# Altium schematic sheet MemoryChip.SchDoc
size A4
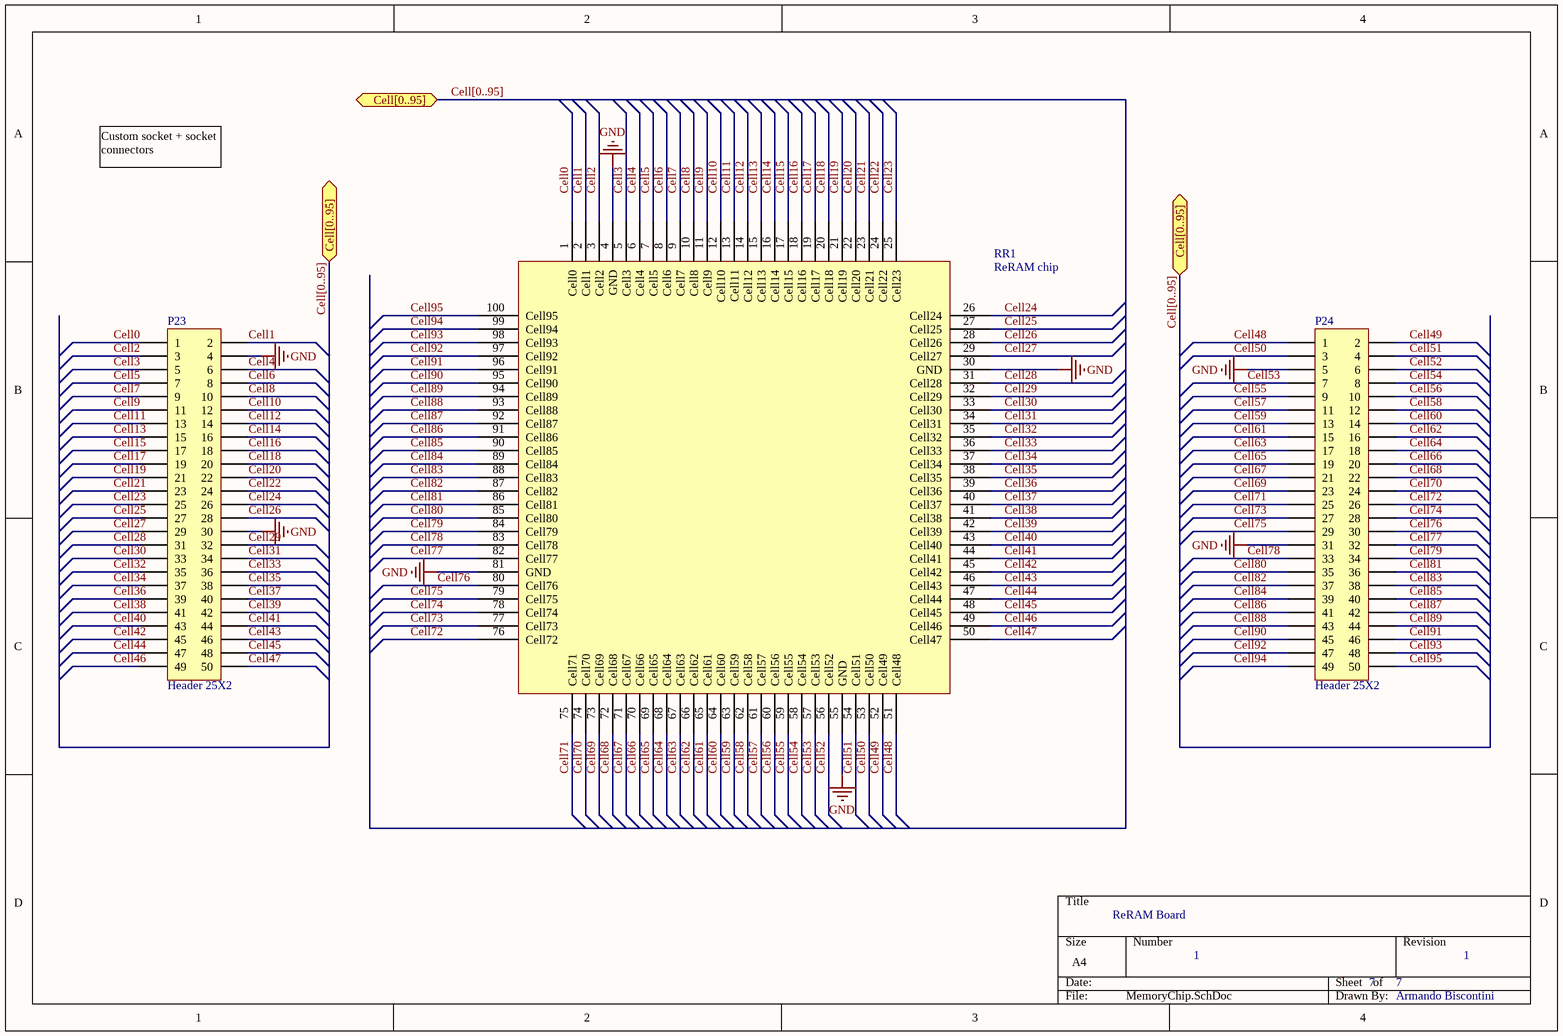
[diagram p0: MemoryChip.SchDoc]

## Parts
P23  Header 25X2  [HDR2X25]
P24  Header 25X2  [HDR2X25]
RR1  ReRAM chip  [LSI-PLLGA100]

## Ports
Cell[0..95]

## Nets
GND: P23.4 P23.30 P24.5 P24.31 RR1.4(GND) RR1.30(GND) RR1.55(GND) RR1.81(GND)
Cell0: P23.1 RR1.1(Cell0)
Cell1: P23.2 RR1.2(Cell1)
Cell2: P23.3 RR1.3(Cell2)
Cell3: P23.5 RR1.5(Cell3)
Cell4: P23.6 RR1.6(Cell4)
Cell5: P23.7 RR1.7(Cell5)
Cell6: P23.8 RR1.8(Cell6)
Cell7: P23.9 RR1.9(Cell7)
Cell8: P23.10 RR1.10(Cell8)
Cell9: P23.11 RR1.11(Cell9)
Cell10: P23.12 RR1.12(Cell10)
Cell11: P23.13 RR1.13(Cell11)
Cell12: P23.14 RR1.14(Cell12)
Cell13: P23.15 RR1.15(Cell13)
Cell14: P23.16 RR1.16(Cell14)
Cell15: P23.17 RR1.17(Cell15)
Cell16: P23.18 RR1.18(Cell16)
Cell17: P23.19 RR1.19(Cell17)
Cell18: P23.20 RR1.20(Cell18)
Cell19: P23.21 RR1.21(Cell19)
Cell20: P23.22 RR1.22(Cell20)
Cell21: P23.23 RR1.23(Cell21)
Cell22: P23.24 RR1.24(Cell22)
Cell23: P23.25 RR1.25(Cell23)
Cell24: P23.26 RR1.26(Cell24)
Cell25: P23.27 RR1.27(Cell25)
Cell26: P23.28 RR1.28(Cell26)
Cell27: P23.29 RR1.29(Cell27)
Cell28: P23.31 RR1.31(Cell28)
Cell29: P23.32 RR1.32(Cell29)
Cell30: P23.33 RR1.33(Cell30)
Cell31: P23.34 RR1.34(Cell31)
Cell32: P23.35 RR1.35(Cell32)
Cell33: P23.36 RR1.36(Cell33)
Cell34: P23.37 RR1.37(Cell34)
Cell35: P23.38 RR1.38(Cell35)
Cell36: P23.39 RR1.39(Cell36)
Cell37: P23.40 RR1.40(Cell37)
Cell38: P23.41 RR1.41(Cell38)
Cell39: P23.42 RR1.42(Cell39)
Cell40: P23.43 RR1.43(Cell40)
Cell41: P23.44 RR1.44(Cell41)
Cell42: P23.45 RR1.45(Cell42)
Cell43: P23.46 RR1.46(Cell43)
Cell44: P23.47 RR1.47(Cell44)
Cell45: P23.48 RR1.48(Cell45)
Cell46: P23.49 RR1.49(Cell46)
Cell47: P23.50 RR1.50(Cell47)
Cell48: P24.1 RR1.51(Cell48)
Cell49: P24.2 RR1.52(Cell49)
Cell50: P24.3 RR1.53(Cell50)
Cell51: P24.4 RR1.54(Cell51)
Cell52: P24.6 RR1.56(Cell52)
Cell53: P24.7 RR1.57(Cell53)
Cell54: P24.8 RR1.58(Cell54)
Cell55: P24.9 RR1.59(Cell55)
Cell56: P24.10 RR1.60(Cell56)
Cell57: P24.11 RR1.61(Cell57)
Cell58: P24.12 RR1.62(Cell58)
Cell59: P24.13 RR1.63(Cell59)
Cell60: P24.14 RR1.64(Cell60)
Cell61: P24.15 RR1.65(Cell61)
Cell62: P24.16 RR1.66(Cell62)
Cell63: P24.17 RR1.67(Cell63)
Cell64: P24.18 RR1.68(Cell64)
Cell65: P24.19 RR1.69(Cell65)
Cell66: P24.20 RR1.70(Cell66)
Cell67: P24.21 RR1.71(Cell67)
Cell68: P24.22 RR1.72(Cell68)
Cell69: P24.23 RR1.73(Cell69)
Cell70: P24.24 RR1.74(Cell70)
Cell71: P24.25 RR1.75(Cell71)
Cell72: P24.26 RR1.76(Cell72)
Cell73: P24.27 RR1.77(Cell73)
Cell74: P24.28 RR1.78(Cell74)
Cell75: P24.29 RR1.79(Cell75)
Cell76: P24.30 RR1.80(Cell76)
Cell77: P24.32 RR1.82(Cell77)
Cell78: P24.33 RR1.83(Cell78)
Cell79: P24.34 RR1.84(Cell79)
Cell80: P24.35 RR1.85(Cell80)
Cell81: P24.36 RR1.86(Cell81)
Cell82: P24.37 RR1.87(Cell82)
Cell83: P24.38 RR1.88(Cell83)
Cell84: P24.39 RR1.89(Cell84)
Cell85: P24.40 RR1.90(Cell85)
Cell86: P24.41 RR1.91(Cell86)
Cell87: P24.42 RR1.92(Cell87)
Cell88: P24.43 RR1.93(Cell88)
Cell89: P24.44 RR1.94(Cell89)
Cell90: P24.45 RR1.95(Cell90)
Cell91: P24.46 RR1.96(Cell91)
Cell92: P24.47 RR1.97(Cell92)
Cell93: P24.48 RR1.98(Cell93)
Cell94: P24.49 RR1.99(Cell94)
Cell95: P24.50 RR1.100(Cell95)

## Buses and harness runs
bus Cell[0..95] = port Cell[0..95]

## Notes on the sheet
- Custom socket + socket connectors
- ReRAM Board
- 1
- 7
- Armando Biscontini

## Library data of the parts
P23 P24 = Header 25X2: Header, 25-Pin, Dual row; LatestRevisionDate: 17-Jul-2002; LatestRevisionNote: Re-released for DXP Platform.; Publisher: Altium Limited
RR1 = ReRAM_LSI-PLLGA100: ReRAM chip on LSI-PLLGA100 custom socket